# Altium project LedMatrix.PrjPCB (part 1 of 2)
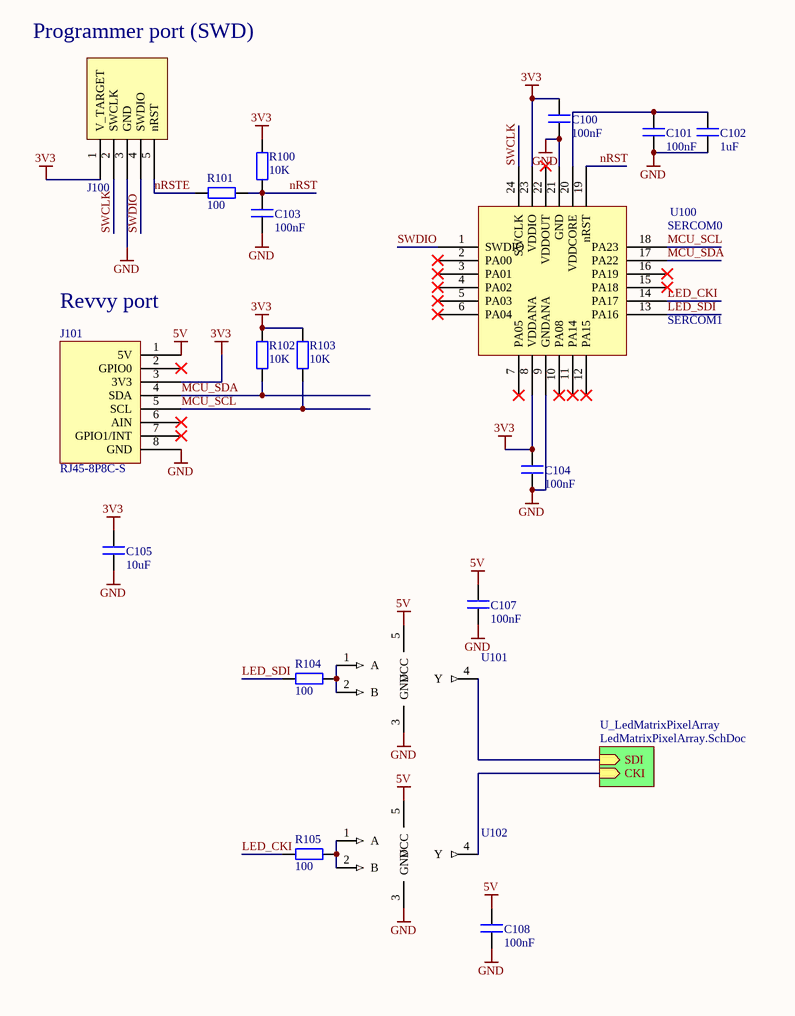
[diagram p0: LedMatrixMain.SchDoc]
3 sheets, 215 parts. Net scope: hierarchical (ports join the sheet entries above them; power ports are global).
Board file: LedMatrix.PcbDoc
Sheets:
  LedMatrixMain.SchDoc
    U_LedMatrixPixelArray = LedMatrixPixelArray.SchDoc
      U_LedMatrixPixel = LedMatrixPixel.SchDoc
      U_LedMatrixPixel = LedMatrixPixel.SchDoc
      U_LedMatrixPixel = LedMatrixPixel.SchDoc
      U_LedMatrixPixel = LedMatrixPixel.SchDoc
      U_LedMatrixPixel = LedMatrixPixel.SchDoc
      U_LedMatrixPixel = LedMatrixPixel.SchDoc
      U_LedMatrixPixel = LedMatrixPixel.SchDoc
      U_LedMatrixPixel = LedMatrixPixel.SchDoc
      U_LedMatrixPixel = LedMatrixPixel.SchDoc
      U_LedMatrixPixel = LedMatrixPixel.SchDoc
      U_LedMatrixPixel = LedMatrixPixel.SchDoc
      U_LedMatrixPixel = LedMatrixPixel.SchDoc
      U_LedMatrixPixel = LedMatrixPixel.SchDoc
      U_LedMatrixPixel = LedMatrixPixel.SchDoc
      U_LedMatrixPixel = LedMatrixPixel.SchDoc
      U_LedMatrixPixel = LedMatrixPixel.SchDoc
      U_LedMatrixPixel = LedMatrixPixel.SchDoc
      U_LedMatrixPixel = LedMatrixPixel.SchDoc
      U_LedMatrixPixel = LedMatrixPixel.SchDoc
      U_LedMatrixPixel = LedMatrixPixel.SchDoc
      U_LedMatrixPixel = LedMatrixPixel.SchDoc
      U_LedMatrixPixel = LedMatrixPixel.SchDoc
      U_LedMatrixPixel = LedMatrixPixel.SchDoc
      U_LedMatrixPixel = LedMatrixPixel.SchDoc
      U_LedMatrixPixel = LedMatrixPixel.SchDoc
      U_LedMatrixPixel = LedMatrixPixel.SchDoc
      U_LedMatrixPixel = LedMatrixPixel.SchDoc
      U_LedMatrixPixel = LedMatrixPixel.SchDoc
      U_LedMatrixPixel = LedMatrixPixel.SchDoc
      U_LedMatrixPixel = LedMatrixPixel.SchDoc
      U_LedMatrixPixel = LedMatrixPixel.SchDoc
      U_LedMatrixPixel = LedMatrixPixel.SchDoc
      U_LedMatrixPixel = LedMatrixPixel.SchDoc
      U_LedMatrixPixel = LedMatrixPixel.SchDoc
      U_LedMatrixPixel = LedMatrixPixel.SchDoc
      U_LedMatrixPixel = LedMatrixPixel.SchDoc
      U_LedMatrixPixel = LedMatrixPixel.SchDoc
      U_LedMatrixPixel = LedMatrixPixel.SchDoc
      U_LedMatrixPixel = LedMatrixPixel.SchDoc
      U_LedMatrixPixel = LedMatrixPixel.SchDoc
      U_LedMatrixPixel = LedMatrixPixel.SchDoc
      U_LedMatrixPixel = LedMatrixPixel.SchDoc
      U_LedMatrixPixel = LedMatrixPixel.SchDoc
      U_LedMatrixPixel = LedMatrixPixel.SchDoc
      U_LedMatrixPixel = LedMatrixPixel.SchDoc
      U_LedMatrixPixel = LedMatrixPixel.SchDoc
      U_LedMatrixPixel = LedMatrixPixel.SchDoc
      U_LedMatrixPixel = LedMatrixPixel.SchDoc
      U_LedMatrixPixel = LedMatrixPixel.SchDoc

## Sheet LedMatrixMain.SchDoc: Led Matrix on Sensor Port
size A4; Revision: 1.0

### Parts
C100  100nF  [CAP1608X06M]
C101  100nF  [CAP1608X06M]
C102  1uF  [CAP1608X06M]
C103  100nF  [CAP1608X06M]
C104  100nF  [CAP1608X06M]
C105  10uF  [CAP1608X06M]
C107  100nF  [CAP1608X06M]
C108  100nF  [CAP1608X06M]
J100  SWD  [Sullins_GRPB051VWVN-RC]  (value not drawn)
J101  RJ45-8P8C-S  [RJ45-8P8C]
R100  10K  [RESC1608X06M]
R101  100  [RESC1608X06M]
R102  10K  [RESC1608X06M]
R103  10K  [RESC1608X06M]
R104  100  [RESC1608X06M]
R105  100  [RESC1608X06M]
U100  ATSAML10D16  [QFN50P400X400X90_HS-25N]  (value not drawn)
U101  OR gate  [SOT95P270X145-5N]  (value not drawn)
U102  OR gate  [SOT95P270X145-5N]  (value not drawn)

### Sub-sheets
U_LedMatrixPixelArray = LedMatrixPixelArray.SchDoc: SDI (in), CKI (in)

### Nets
3V3: C100.2 C104.2 C105.2 J100.1(V_TARGET) J101.3(3V3) R100.2 R102.2 R103.2 U100.8(VDDANA) U100.23(VDDIO)
5V: C107.2 C108.2 J101.1(5V) U101.5(VCC) U102.5(VCC)
GND: C100.1 C101.1 C102.1 C103.1 C104.1 C105.1 C107.1 C108.1 J100.3(GND) J101.8(GND) U100.9(GNDANA) U100.21(GND) U101.3(GND) U102.3(GND)
LED_CKI: R105.1 U100.14(PA17)
LED_SDI: R104.1 U100.13(PA16)
MCU_SCL: J101.5(SCL) R103.1 U100.18(PA23)
MCU_SDA: J101.4(SDA) R102.1 U100.17(PA22)
nRST: C103.2 R100.1 R101.2 U100.19(nRST)
nRSTE: J100.5(nRST) R101.1
SWCLK: J100.2(SWCLK) U100.24(SWCLK)
SWDIO: J100.4(SWDIO) U100.1(SWDIO)
NetC101_2: C101.2 C102.2 U100.20(VDDCORE)
NetR104_2: R104.2 U101.1(A) U101.2(B)
NetR105_2: R105.2 U102.1(A) U102.2(B)
NetR200_U_LedMatrixPixel43_1: U101.4(Y) ; sheet U_LedMatrixPixelArray/SDI
NetR201_U_LedMatrixPixel43_1: U102.4(Y) ; sheet U_LedMatrixPixelArray/CKI

Not connected (* = marked no-connect by the designer): J101 2(GPIO0)* 6(AIN)* 7(GPIO1/INT)*; U100 2(PA00)* 3(PA01)* 4(PA02)* 5(PA03)* 6(PA04)* 7(PA05)* 10(PA08)* 11(PA14)* 12(PA15)* 15(PA18)* 16(PA19)* 22(VDDOUT)*

### Notes on the sheet
- Programmer port (SWD)
- (near U100) SERCOM0
- (near J101) Revvy port
- (near U100) SERCOM1

### Library data of the parts
C100 C101 C103 C104 C107 C108 = Capacitor 100n: Value: 100nF
C102 = Capacitor 1u: Value: 1uF
C105 = Capacitor 10u: Value: 10uF
R100 R102 R103 = Resistor 10K: Value: 10K
R101 R104 R105 = Resistor 100: Value: 100
U100 = ATSAML10D16: 48MHz 32bit ARM MCU; Flash size: 16kB; RAM size: 4kB
U101 U102 = SN74LV1T32: Manufacturer_Name: Texas Instruments; Manufacturer_Part_Number: SN74LV1T32DCKR; Datasheet Link: http://www.ti.com/lit/ds/symlink/sn74lv1t32.pdf; Mouser2 Price/Stock: https://hu.mouser.com/Search/Refine?Keyword=SN74LV1T32DCKR; Mouser code: 595-SN74LV1T32DCKR
J101 = RJ45-8P8C-S: Datasheet: /Robotics%20Platform/Datasheets/Connectors/5721-8P8C-全塑有耳.pdf

## Sheet LedMatrixPixelArray.SchDoc
size A4
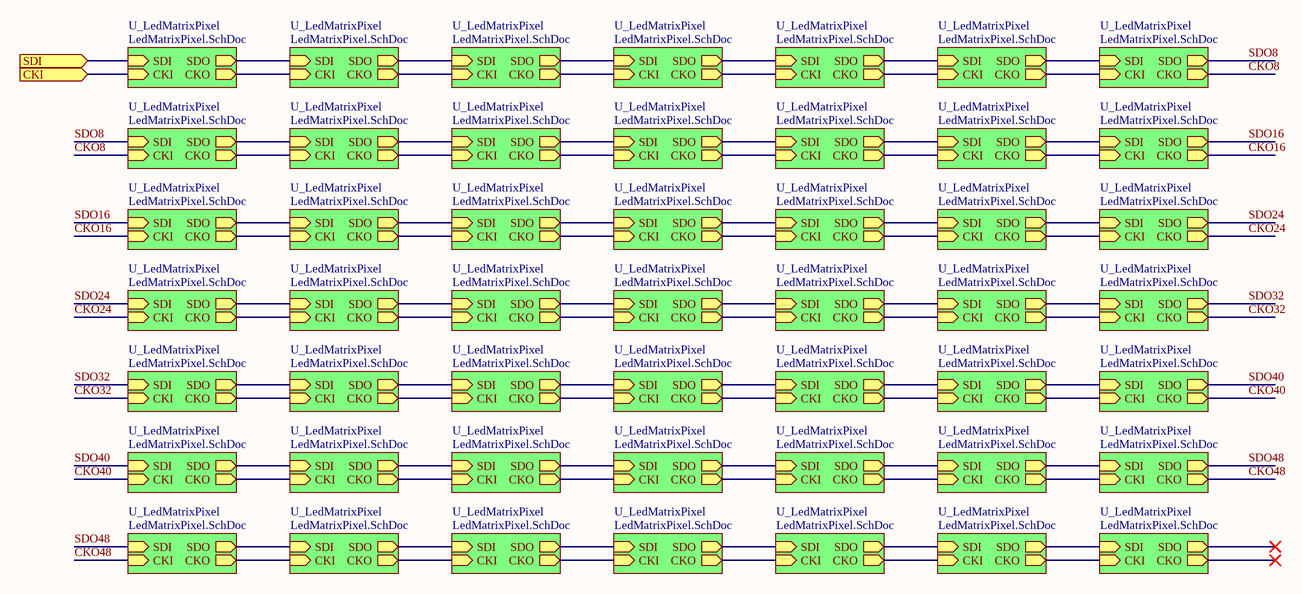
[diagram p1: LedMatrixPixelArray.SchDoc]

### Sub-sheets
U_LedMatrixPixel = LedMatrixPixel.SchDoc: SDI (in), CKI (in), SDO (out), CKO (out)
U_LedMatrixPixel = LedMatrixPixel.SchDoc: SDI (in), CKI (in), SDO (out), CKO (out)
U_LedMatrixPixel = LedMatrixPixel.SchDoc: SDI (in), CKI (in), SDO (out), CKO (out)
U_LedMatrixPixel = LedMatrixPixel.SchDoc: SDI (in), CKI (in), SDO (out), CKO (out)
U_LedMatrixPixel = LedMatrixPixel.SchDoc: SDI (in), CKI (in), SDO (out), CKO (out)
U_LedMatrixPixel = LedMatrixPixel.SchDoc: SDI (in), CKI (in), SDO (out), CKO (out)
U_LedMatrixPixel = LedMatrixPixel.SchDoc: SDI (in), CKI (in), SDO (out), CKO (out)
U_LedMatrixPixel = LedMatrixPixel.SchDoc: SDI (in), CKI (in), SDO (out), CKO (out)
U_LedMatrixPixel = LedMatrixPixel.SchDoc: SDI (in), CKI (in), SDO (out), CKO (out)
U_LedMatrixPixel = LedMatrixPixel.SchDoc: SDI (in), CKI (in), SDO (out), CKO (out)
U_LedMatrixPixel = LedMatrixPixel.SchDoc: SDI (in), CKI (in), SDO (out), CKO (out)
U_LedMatrixPixel = LedMatrixPixel.SchDoc: SDI (in), CKI (in), SDO (out), CKO (out)
U_LedMatrixPixel = LedMatrixPixel.SchDoc: SDI (in), CKI (in), SDO (out), CKO (out)
U_LedMatrixPixel = LedMatrixPixel.SchDoc: SDI (in), CKI (in), SDO (out), CKO (out)
U_LedMatrixPixel = LedMatrixPixel.SchDoc: SDI (in), CKI (in), SDO (out), CKO (out)
U_LedMatrixPixel = LedMatrixPixel.SchDoc: SDI (in), CKI (in), SDO (out), CKO (out)
U_LedMatrixPixel = LedMatrixPixel.SchDoc: SDI (in), CKI (in), SDO (out), CKO (out)
U_LedMatrixPixel = LedMatrixPixel.SchDoc: SDI (in), CKI (in), SDO (out), CKO (out)
U_LedMatrixPixel = LedMatrixPixel.SchDoc: SDI (in), CKI (in), SDO (out), CKO (out)
U_LedMatrixPixel = LedMatrixPixel.SchDoc: SDI (in), CKI (in), SDO (out), CKO (out)
U_LedMatrixPixel = LedMatrixPixel.SchDoc: SDI (in), CKI (in), SDO (out), CKO (out)
U_LedMatrixPixel = LedMatrixPixel.SchDoc: SDI (in), CKI (in), SDO (out), CKO (out)
U_LedMatrixPixel = LedMatrixPixel.SchDoc: SDI (in), CKI (in), SDO (out), CKO (out)
U_LedMatrixPixel = LedMatrixPixel.SchDoc: SDI (in), CKI (in), SDO (out), CKO (out)
U_LedMatrixPixel = LedMatrixPixel.SchDoc: SDI (in), CKI (in), SDO (out), CKO (out)
U_LedMatrixPixel = LedMatrixPixel.SchDoc: SDI (in), CKI (in), SDO (out), CKO (out)
U_LedMatrixPixel = LedMatrixPixel.SchDoc: SDI (in), CKI (in), SDO (out), CKO (out)
U_LedMatrixPixel = LedMatrixPixel.SchDoc: SDI (in), CKI (in), SDO (out), CKO (out)
U_LedMatrixPixel = LedMatrixPixel.SchDoc: SDI (in), CKI (in), SDO (out), CKO (out)
U_LedMatrixPixel = LedMatrixPixel.SchDoc: SDI (in), CKI (in), SDO (out), CKO (out)
U_LedMatrixPixel = LedMatrixPixel.SchDoc: SDI (in), CKI (in), SDO (out), CKO (out)
U_LedMatrixPixel = LedMatrixPixel.SchDoc: SDI (in), CKI (in), SDO (out), CKO (out)
U_LedMatrixPixel = LedMatrixPixel.SchDoc: SDI (in), CKI (in), SDO (out), CKO (out)
U_LedMatrixPixel = LedMatrixPixel.SchDoc: SDI (in), CKI (in), SDO (out), CKO (out)
U_LedMatrixPixel = LedMatrixPixel.SchDoc: SDI (in), CKI (in), SDO (out), CKO (out)
U_LedMatrixPixel = LedMatrixPixel.SchDoc: SDI (in), CKI (in), SDO (out), CKO (out)
U_LedMatrixPixel = LedMatrixPixel.SchDoc: SDI (in), CKI (in), SDO (out), CKO (out)
U_LedMatrixPixel = LedMatrixPixel.SchDoc: SDI (in), CKI (in), SDO (out), CKO (out)
U_LedMatrixPixel = LedMatrixPixel.SchDoc: SDI (in), CKI (in), SDO (out), CKO (out)
U_LedMatrixPixel = LedMatrixPixel.SchDoc: SDI (in), CKI (in), SDO (out), CKO (out)
U_LedMatrixPixel = LedMatrixPixel.SchDoc: SDI (in), CKI (in), SDO (out), CKO (out)
U_LedMatrixPixel = LedMatrixPixel.SchDoc: SDI (in), CKI (in), SDO (out), CKO (out)
U_LedMatrixPixel = LedMatrixPixel.SchDoc: SDI (in), CKI (in), SDO (out), CKO (out)
U_LedMatrixPixel = LedMatrixPixel.SchDoc: SDI (in), CKI (in), SDO (out), CKO (out)
U_LedMatrixPixel = LedMatrixPixel.SchDoc: SDI (in), CKI (in), SDO (out), CKO (out)
U_LedMatrixPixel = LedMatrixPixel.SchDoc: SDI (in), CKI (in), SDO (out), CKO (out)
U_LedMatrixPixel = LedMatrixPixel.SchDoc: SDI (in), CKI (in), SDO (out), CKO (out)
U_LedMatrixPixel = LedMatrixPixel.SchDoc: SDI (in), CKI (in), SDO (out), CKO (out)
U_LedMatrixPixel = LedMatrixPixel.SchDoc: SDI (in), CKI (in), SDO (out), CKO (out)

### Ports
CKI (in), SDI (in)

### Nets
CKO8: sheet U_LedMatrixPixel/CKI, sheet U_LedMatrixPixel/CKO
CKO16: sheet U_LedMatrixPixel/CKI, sheet U_LedMatrixPixel/CKO
CKO24: sheet U_LedMatrixPixel/CKI, sheet U_LedMatrixPixel/CKO
CKO32: sheet U_LedMatrixPixel/CKI, sheet U_LedMatrixPixel/CKO
CKO40: sheet U_LedMatrixPixel/CKI, sheet U_LedMatrixPixel/CKO
CKO48: sheet U_LedMatrixPixel/CKI, sheet U_LedMatrixPixel/CKO
SDO8: sheet U_LedMatrixPixel/SDI, sheet U_LedMatrixPixel/SDO
SDO16: sheet U_LedMatrixPixel/SDI, sheet U_LedMatrixPixel/SDO
SDO24: sheet U_LedMatrixPixel/SDI, sheet U_LedMatrixPixel/SDO
SDO32: sheet U_LedMatrixPixel/SDI, sheet U_LedMatrixPixel/SDO
SDO40: sheet U_LedMatrixPixel/SDI, sheet U_LedMatrixPixel/SDO
SDO48: sheet U_LedMatrixPixel/SDI, sheet U_LedMatrixPixel/SDO
NetR200_U_LedMatrixPixel1_1: sheet U_LedMatrixPixel/SDO, sheet U_LedMatrixPixel/SDI
NetR200_U_LedMatrixPixel2_1: sheet U_LedMatrixPixel/SDO, sheet U_LedMatrixPixel/SDI
NetR200_U_LedMatrixPixel3_1: sheet U_LedMatrixPixel/SDO, sheet U_LedMatrixPixel/SDI
NetR200_U_LedMatrixPixel4_1: sheet U_LedMatrixPixel/SDO, sheet U_LedMatrixPixel/SDI
NetR200_U_LedMatrixPixel5_1: sheet U_LedMatrixPixel/SDO, sheet U_LedMatrixPixel/SDI
NetR200_U_LedMatrixPixel6_1: sheet U_LedMatrixPixel/SDO, sheet U_LedMatrixPixel/SDI
NetR200_U_LedMatrixPixel7_1: sheet U_LedMatrixPixel/SDO, sheet U_LedMatrixPixel/SDI
NetR200_U_LedMatrixPixel8_1: sheet U_LedMatrixPixel/SDO, sheet U_LedMatrixPixel/SDI
NetR200_U_LedMatrixPixel9_1: sheet U_LedMatrixPixel/SDO, sheet U_LedMatrixPixel/SDI
NetR200_U_LedMatrixPixel10_1: sheet U_LedMatrixPixel/SDO, sheet U_LedMatrixPixel/SDI
NetR200_U_LedMatrixPixel11_1: sheet U_LedMatrixPixel/SDO, sheet U_LedMatrixPixel/SDI
NetR200_U_LedMatrixPixel12_1: sheet U_LedMatrixPixel/SDO, sheet U_LedMatrixPixel/SDI
NetR200_U_LedMatrixPixel13_1: sheet U_LedMatrixPixel/SDO, sheet U_LedMatrixPixel/SDI
NetR200_U_LedMatrixPixel14_1: sheet U_LedMatrixPixel/SDO, sheet U_LedMatrixPixel/SDI
NetR200_U_LedMatrixPixel15_1: sheet U_LedMatrixPixel/SDO, sheet U_LedMatrixPixel/SDI
NetR200_U_LedMatrixPixel16_1: sheet U_LedMatrixPixel/SDO, sheet U_LedMatrixPixel/SDI
NetR200_U_LedMatrixPixel17_1: sheet U_LedMatrixPixel/SDO, sheet U_LedMatrixPixel/SDI
NetR200_U_LedMatrixPixel18_1: sheet U_LedMatrixPixel/SDO, sheet U_LedMatrixPixel/SDI
NetR200_U_LedMatrixPixel19_1: sheet U_LedMatrixPixel/SDO, sheet U_LedMatrixPixel/SDI
NetR200_U_LedMatrixPixel20_1: sheet U_LedMatrixPixel/SDO, sheet U_LedMatrixPixel/SDI
NetR200_U_LedMatrixPixel21_1: sheet U_LedMatrixPixel/SDO, sheet U_LedMatrixPixel/SDI
NetR200_U_LedMatrixPixel22_1: sheet U_LedMatrixPixel/SDO, sheet U_LedMatrixPixel/SDI
NetR200_U_LedMatrixPixel23_1: sheet U_LedMatrixPixel/SDO, sheet U_LedMatrixPixel/SDI
NetR200_U_LedMatrixPixel24_1: sheet U_LedMatrixPixel/SDO, sheet U_LedMatrixPixel/SDI
NetR200_U_LedMatrixPixel25_1: sheet U_LedMatrixPixel/SDO, sheet U_LedMatrixPixel/SDI
NetR200_U_LedMatrixPixel26_1: sheet U_LedMatrixPixel/SDO, sheet U_LedMatrixPixel/SDI
NetR200_U_LedMatrixPixel27_1: sheet U_LedMatrixPixel/SDO, sheet U_LedMatrixPixel/SDI
NetR200_U_LedMatrixPixel28_1: sheet U_LedMatrixPixel/SDO, sheet U_LedMatrixPixel/SDI
NetR200_U_LedMatrixPixel29_1: sheet U_LedMatrixPixel/SDO, sheet U_LedMatrixPixel/SDI
NetR200_U_LedMatrixPixel30_1: sheet U_LedMatrixPixel/SDO, sheet U_LedMatrixPixel/SDI
NetR200_U_LedMatrixPixel31_1: sheet U_LedMatrixPixel/SDO, sheet U_LedMatrixPixel/SDI
NetR200_U_LedMatrixPixel32_1: sheet U_LedMatrixPixel/SDO, sheet U_LedMatrixPixel/SDI
NetR200_U_LedMatrixPixel33_1: sheet U_LedMatrixPixel/SDO, sheet U_LedMatrixPixel/SDI
NetR200_U_LedMatrixPixel34_1: sheet U_LedMatrixPixel/SDO, sheet U_LedMatrixPixel/SDI
NetR200_U_LedMatrixPixel35_1: sheet U_LedMatrixPixel/SDO, sheet U_LedMatrixPixel/SDI
NetR200_U_LedMatrixPixel36_1: sheet U_LedMatrixPixel/SDO, sheet U_LedMatrixPixel/SDI
NetR200_U_LedMatrixPixel37_1: sheet U_LedMatrixPixel/SDO, sheet U_LedMatrixPixel/SDI
NetR200_U_LedMatrixPixel38_1: sheet U_LedMatrixPixel/SDO, sheet U_LedMatrixPixel/SDI
NetR200_U_LedMatrixPixel39_1: sheet U_LedMatrixPixel/SDO, sheet U_LedMatrixPixel/SDI
NetR200_U_LedMatrixPixel40_1: sheet U_LedMatrixPixel/SDO, sheet U_LedMatrixPixel/SDI
NetR200_U_LedMatrixPixel41_1: sheet U_LedMatrixPixel/SDO, sheet U_LedMatrixPixel/SDI
NetR200_U_LedMatrixPixel42_1: sheet U_LedMatrixPixel/SDO, sheet U_LedMatrixPixel/SDI
NetR200_U_LedMatrixPixel43_1: port SDI, sheet U_LedMatrixPixel/SDI
NetR201_U_LedMatrixPixel1_1: sheet U_LedMatrixPixel/CKO, sheet U_LedMatrixPixel/CKI
NetR201_U_LedMatrixPixel2_1: sheet U_LedMatrixPixel/CKO, sheet U_LedMatrixPixel/CKI
NetR201_U_LedMatrixPixel3_1: sheet U_LedMatrixPixel/CKO, sheet U_LedMatrixPixel/CKI
NetR201_U_LedMatrixPixel4_1: sheet U_LedMatrixPixel/CKO, sheet U_LedMatrixPixel/CKI
NetR201_U_LedMatrixPixel5_1: sheet U_LedMatrixPixel/CKO, sheet U_LedMatrixPixel/CKI
NetR201_U_LedMatrixPixel6_1: sheet U_LedMatrixPixel/CKO, sheet U_LedMatrixPixel/CKI
NetR201_U_LedMatrixPixel7_1: sheet U_LedMatrixPixel/CKO, sheet U_LedMatrixPixel/CKI
NetR201_U_LedMatrixPixel8_1: sheet U_LedMatrixPixel/CKO, sheet U_LedMatrixPixel/CKI
NetR201_U_LedMatrixPixel9_1: sheet U_LedMatrixPixel/CKO, sheet U_LedMatrixPixel/CKI
NetR201_U_LedMatrixPixel10_1: sheet U_LedMatrixPixel/CKO, sheet U_LedMatrixPixel/CKI
NetR201_U_LedMatrixPixel11_1: sheet U_LedMatrixPixel/CKO, sheet U_LedMatrixPixel/CKI
NetR201_U_LedMatrixPixel12_1: sheet U_LedMatrixPixel/CKO, sheet U_LedMatrixPixel/CKI
NetR201_U_LedMatrixPixel13_1: sheet U_LedMatrixPixel/CKO, sheet U_LedMatrixPixel/CKI
NetR201_U_LedMatrixPixel14_1: sheet U_LedMatrixPixel/CKO, sheet U_LedMatrixPixel/CKI
NetR201_U_LedMatrixPixel15_1: sheet U_LedMatrixPixel/CKO, sheet U_LedMatrixPixel/CKI
NetR201_U_LedMatrixPixel16_1: sheet U_LedMatrixPixel/CKO, sheet U_LedMatrixPixel/CKI
NetR201_U_LedMatrixPixel17_1: sheet U_LedMatrixPixel/CKO, sheet U_LedMatrixPixel/CKI
NetR201_U_LedMatrixPixel18_1: sheet U_LedMatrixPixel/CKO, sheet U_LedMatrixPixel/CKI
NetR201_U_LedMatrixPixel19_1: sheet U_LedMatrixPixel/CKO, sheet U_LedMatrixPixel/CKI
NetR201_U_LedMatrixPixel20_1: sheet U_LedMatrixPixel/CKO, sheet U_LedMatrixPixel/CKI
NetR201_U_LedMatrixPixel21_1: sheet U_LedMatrixPixel/CKO, sheet U_LedMatrixPixel/CKI
NetR201_U_LedMatrixPixel22_1: sheet U_LedMatrixPixel/CKO, sheet U_LedMatrixPixel/CKI
NetR201_U_LedMatrixPixel23_1: sheet U_LedMatrixPixel/CKO, sheet U_LedMatrixPixel/CKI
NetR201_U_LedMatrixPixel24_1: sheet U_LedMatrixPixel/CKO, sheet U_LedMatrixPixel/CKI
NetR201_U_LedMatrixPixel25_1: sheet U_LedMatrixPixel/CKO, sheet U_LedMatrixPixel/CKI
NetR201_U_LedMatrixPixel26_1: sheet U_LedMatrixPixel/CKO, sheet U_LedMatrixPixel/CKI
NetR201_U_LedMatrixPixel27_1: sheet U_LedMatrixPixel/CKO, sheet U_LedMatrixPixel/CKI
NetR201_U_LedMatrixPixel28_1: sheet U_LedMatrixPixel/CKO, sheet U_LedMatrixPixel/CKI
NetR201_U_LedMatrixPixel29_1: sheet U_LedMatrixPixel/CKO, sheet U_LedMatrixPixel/CKI
NetR201_U_LedMatrixPixel30_1: sheet U_LedMatrixPixel/CKO, sheet U_LedMatrixPixel/CKI
NetR201_U_LedMatrixPixel31_1: sheet U_LedMatrixPixel/CKO, sheet U_LedMatrixPixel/CKI
NetR201_U_LedMatrixPixel32_1: sheet U_LedMatrixPixel/CKO, sheet U_LedMatrixPixel/CKI
NetR201_U_LedMatrixPixel33_1: sheet U_LedMatrixPixel/CKO, sheet U_LedMatrixPixel/CKI
NetR201_U_LedMatrixPixel34_1: sheet U_LedMatrixPixel/CKO, sheet U_LedMatrixPixel/CKI
NetR201_U_LedMatrixPixel35_1: sheet U_LedMatrixPixel/CKO, sheet U_LedMatrixPixel/CKI
NetR201_U_LedMatrixPixel36_1: sheet U_LedMatrixPixel/CKO, sheet U_LedMatrixPixel/CKI
NetR201_U_LedMatrixPixel37_1: sheet U_LedMatrixPixel/CKO, sheet U_LedMatrixPixel/CKI
NetR201_U_LedMatrixPixel38_1: sheet U_LedMatrixPixel/CKO, sheet U_LedMatrixPixel/CKI
NetR201_U_LedMatrixPixel39_1: sheet U_LedMatrixPixel/CKO, sheet U_LedMatrixPixel/CKI
NetR201_U_LedMatrixPixel40_1: sheet U_LedMatrixPixel/CKO, sheet U_LedMatrixPixel/CKI
NetR201_U_LedMatrixPixel41_1: sheet U_LedMatrixPixel/CKO, sheet U_LedMatrixPixel/CKI
NetR201_U_LedMatrixPixel42_1: sheet U_LedMatrixPixel/CKO, sheet U_LedMatrixPixel/CKI
NetR201_U_LedMatrixPixel43_1: port CKI, sheet U_LedMatrixPixel/CKI

## Sheet LedMatrixPixel.SchDoc
size A4
Used 49 times, as channels U_LedMatrixPixelArray/U_LedMatrixPixel, U_LedMatrixPixelArray/U_LedMatrixPixel, U_LedMatrixPixelArray/U_LedMatrixPixel, U_LedMatrixPixelArray/U_LedMatrixPixel, U_LedMatrixPixelArray/U_LedMatrixPixel, U_LedMatrixPixelArray/U_LedMatrixPixel, U_LedMatrixPixelArray/U_LedMatrixPixel, U_LedMatrixPixelArray/U_LedMatrixPixel, U_LedMatrixPixelArray/U_LedMatrixPixel, U_LedMatrixPixelArray/U_LedMatrixPixel, U_LedMatrixPixelArray/U_LedMatrixPixel, U_LedMatrixPixelArray/U_LedMatrixPixel, U_LedMatrixPixelArray/U_LedMatrixPixel, U_LedMatrixPixelArray/U_LedMatrixPixel, U_LedMatrixPixelArray/U_LedMatrixPixel, U_LedMatrixPixelArray/U_LedMatrixPixel, U_LedMatrixPixelArray/U_LedMatrixPixel, U_LedMatrixPixelArray/U_LedMatrixPixel, U_LedMatrixPixelArray/U_LedMatrixPixel, U_LedMatrixPixelArray/U_LedMatrixPixel, U_LedMatrixPixelArray/U_LedMatrixPixel, U_LedMatrixPixelArray/U_LedMatrixPixel, U_LedMatrixPixelArray/U_LedMatrixPixel, U_LedMatrixPixelArray/U_LedMatrixPixel, U_LedMatrixPixelArray/U_LedMatrixPixel, U_LedMatrixPixelArray/U_LedMatrixPixel, U_LedMatrixPixelArray/U_LedMatrixPixel, U_LedMatrixPixelArray/U_LedMatrixPixel, U_LedMatrixPixelArray/U_LedMatrixPixel, U_LedMatrixPixelArray/U_LedMatrixPixel, U_LedMatrixPixelArray/U_LedMatrixPixel, U_LedMatrixPixelArray/U_LedMatrixPixel, U_LedMatrixPixelArray/U_LedMatrixPixel, U_LedMatrixPixelArray/U_LedMatrixPixel, U_LedMatrixPixelArray/U_LedMatrixPixel, U_LedMatrixPixelArray/U_LedMatrixPixel, U_LedMatrixPixelArray/U_LedMatrixPixel, U_LedMatrixPixelArray/U_LedMatrixPixel, U_LedMatrixPixelArray/U_LedMatrixPixel, U_LedMatrixPixelArray/U_LedMatrixPixel, U_LedMatrixPixelArray/U_LedMatrixPixel, U_LedMatrixPixelArray/U_LedMatrixPixel, U_LedMatrixPixelArray/U_LedMatrixPixel, U_LedMatrixPixelArray/U_LedMatrixPixel, U_LedMatrixPixelArray/U_LedMatrixPixel, U_LedMatrixPixelArray/U_LedMatrixPixel, U_LedMatrixPixelArray/U_LedMatrixPixel, U_LedMatrixPixelArray/U_LedMatrixPixel, U_LedMatrixPixelArray/U_LedMatrixPixel. Parts and nets are listed once, with the designators drawn on the sheet.
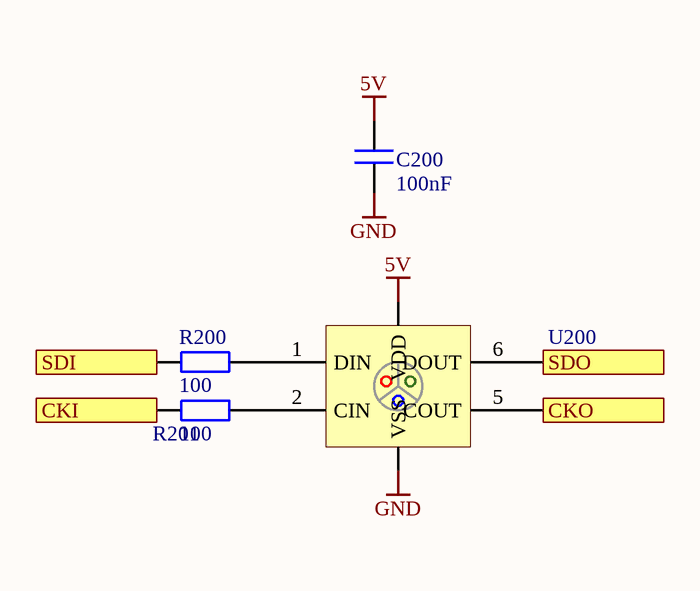
[diagram p2: LedMatrixPixel.SchDoc]

### Parts
C200  100nF  [CAP1608X06M]
R200  100  [RESC1608X06M]
R201  100  [RESC1608X06M]
U200  APA102-2020  [APA102]  (value not drawn)

### Ports
CKI (in), CKO (out), SDI (in), SDO (out)

### Nets
5V: C200.2 U200.4(VDD)
GND: C200.1 U200.3(VSS)
CKI: R201.1 ; port CKI
CKO: U200.5(COUT) ; port CKO
SDI: R200.1 ; port SDI
SDO: U200.6(DOUT) ; port SDO
NetR200_2: R200.2 U200.1(DIN)
NetR201_2: R201.2 U200.2(CIN)

### Channels
U_LedMatrixPixelArray/U_LedMatrixPixel: designators end in _U_LedMatrixPixel49; ports CKI=CKO48 CKO=NetR201_U_LedMatrixPixel42_1 SDI=SDO48 SDO=NetR200_U_LedMatrixPixel42_1
U_LedMatrixPixelArray/U_LedMatrixPixel: designators end in _U_LedMatrixPixel48; ports CKI=CKO40 CKO=NetR201_U_LedMatrixPixel41_1 SDI=SDO40 SDO=NetR200_U_LedMatrixPixel41_1
U_LedMatrixPixelArray/U_LedMatrixPixel: designators end in _U_LedMatrixPixel47; ports CKI=CKO32 CKO=NetR201_U_LedMatrixPixel40_1 SDI=SDO32 SDO=NetR200_U_LedMatrixPixel40_1
U_LedMatrixPixelArray/U_LedMatrixPixel: designators end in _U_LedMatrixPixel46; ports CKI=CKO24 CKO=NetR201_U_LedMatrixPixel39_1 SDI=SDO24 SDO=NetR200_U_LedMatrixPixel39_1
U_LedMatrixPixelArray/U_LedMatrixPixel: designators end in _U_LedMatrixPixel45; ports CKI=CKO16 CKO=NetR201_U_LedMatrixPixel38_1 SDI=SDO16 SDO=NetR200_U_LedMatrixPixel38_1
U_LedMatrixPixelArray/U_LedMatrixPixel: designators end in _U_LedMatrixPixel44; ports CKI=CKO8 CKO=NetR201_U_LedMatrixPixel37_1 SDI=SDO8 SDO=NetR200_U_LedMatrixPixel37_1
U_LedMatrixPixelArray/U_LedMatrixPixel: designators end in _U_LedMatrixPixel43; ports CKI=NetR201_U_LedMatrixPixel43_1 CKO=NetR201_U_LedMatrixPixel36_1 SDI=NetR200_U_LedMatrixPixel43_1 SDO=NetR200_U_LedMatrixPixel36_1
U_LedMatrixPixelArray/U_LedMatrixPixel: designators end in _U_LedMatrixPixel42; ports CKI=NetR201_U_LedMatrixPixel42_1 CKO=NetR201_U_LedMatrixPixel35_1 SDI=NetR200_U_LedMatrixPixel42_1 SDO=NetR200_U_LedMatrixPixel35_1
U_LedMatrixPixelArray/U_LedMatrixPixel: designators end in _U_LedMatrixPixel41; ports CKI=NetR201_U_LedMatrixPixel41_1 CKO=NetR201_U_LedMatrixPixel34_1 SDI=NetR200_U_LedMatrixPixel41_1 SDO=NetR200_U_LedMatrixPixel34_1
U_LedMatrixPixelArray/U_LedMatrixPixel: designators end in _U_LedMatrixPixel40; ports CKI=NetR201_U_LedMatrixPixel40_1 CKO=NetR201_U_LedMatrixPixel33_1 SDI=NetR200_U_LedMatrixPixel40_1 SDO=NetR200_U_LedMatrixPixel33_1
U_LedMatrixPixelArray/U_LedMatrixPixel: designators end in _U_LedMatrixPixel39; ports CKI=NetR201_U_LedMatrixPixel39_1 CKO=NetR201_U_LedMatrixPixel32_1 SDI=NetR200_U_LedMatrixPixel39_1 SDO=NetR200_U_LedMatrixPixel32_1
U_LedMatrixPixelArray/U_LedMatrixPixel: designators end in _U_LedMatrixPixel38; ports CKI=NetR201_U_LedMatrixPixel38_1 CKO=NetR201_U_LedMatrixPixel31_1 SDI=NetR200_U_LedMatrixPixel38_1 SDO=NetR200_U_LedMatrixPixel31_1
U_LedMatrixPixelArray/U_LedMatrixPixel: designators end in _U_LedMatrixPixel37; ports CKI=NetR201_U_LedMatrixPixel37_1 CKO=NetR201_U_LedMatrixPixel30_1 SDI=NetR200_U_LedMatrixPixel37_1 SDO=NetR200_U_LedMatrixPixel30_1
U_LedMatrixPixelArray/U_LedMatrixPixel: designators end in _U_LedMatrixPixel36; ports CKI=NetR201_U_LedMatrixPixel36_1 CKO=NetR201_U_LedMatrixPixel29_1 SDI=NetR200_U_LedMatrixPixel36_1 SDO=NetR200_U_LedMatrixPixel29_1
U_LedMatrixPixelArray/U_LedMatrixPixel: designators end in _U_LedMatrixPixel35; ports CKI=NetR201_U_LedMatrixPixel35_1 CKO=NetR201_U_LedMatrixPixel28_1 SDI=NetR200_U_LedMatrixPixel35_1 SDO=NetR200_U_LedMatrixPixel28_1
U_LedMatrixPixelArray/U_LedMatrixPixel: designators end in _U_LedMatrixPixel34; ports CKI=NetR201_U_LedMatrixPixel34_1 CKO=NetR201_U_LedMatrixPixel27_1 SDI=NetR200_U_LedMatrixPixel34_1 SDO=NetR200_U_LedMatrixPixel27_1
U_LedMatrixPixelArray/U_LedMatrixPixel: designators end in _U_LedMatrixPixel33; ports CKI=NetR201_U_LedMatrixPixel33_1 CKO=NetR201_U_LedMatrixPixel26_1 SDI=NetR200_U_LedMatrixPixel33_1 SDO=NetR200_U_LedMatrixPixel26_1
U_LedMatrixPixelArray/U_LedMatrixPixel: designators end in _U_LedMatrixPixel32; ports CKI=NetR201_U_LedMatrixPixel32_1 CKO=NetR201_U_LedMatrixPixel25_1 SDI=NetR200_U_LedMatrixPixel32_1 SDO=NetR200_U_LedMatrixPixel25_1
U_LedMatrixPixelArray/U_LedMatrixPixel: designators end in _U_LedMatrixPixel31; ports CKI=NetR201_U_LedMatrixPixel31_1 CKO=NetR201_U_LedMatrixPixel24_1 SDI=NetR200_U_LedMatrixPixel31_1 SDO=NetR200_U_LedMatrixPixel24_1
U_LedMatrixPixelArray/U_LedMatrixPixel: designators end in _U_LedMatrixPixel30; ports CKI=NetR201_U_LedMatrixPixel30_1 CKO=NetR201_U_LedMatrixPixel23_1 SDI=NetR200_U_LedMatrixPixel30_1 SDO=NetR200_U_LedMatrixPixel23_1
U_LedMatrixPixelArray/U_LedMatrixPixel: designators end in _U_LedMatrixPixel29; ports CKI=NetR201_U_LedMatrixPixel29_1 CKO=NetR201_U_LedMatrixPixel22_1 SDI=NetR200_U_LedMatrixPixel29_1 SDO=NetR200_U_LedMatrixPixel22_1
U_LedMatrixPixelArray/U_LedMatrixPixel: designators end in _U_LedMatrixPixel28; ports CKI=NetR201_U_LedMatrixPixel28_1 CKO=NetR201_U_LedMatrixPixel21_1 SDI=NetR200_U_LedMatrixPixel28_1 SDO=NetR200_U_LedMatrixPixel21_1
U_LedMatrixPixelArray/U_LedMatrixPixel: designators end in _U_LedMatrixPixel27; ports CKI=NetR201_U_LedMatrixPixel27_1 CKO=NetR201_U_LedMatrixPixel20_1 SDI=NetR200_U_LedMatrixPixel27_1 SDO=NetR200_U_LedMatrixPixel20_1
U_LedMatrixPixelArray/U_LedMatrixPixel: designators end in _U_LedMatrixPixel26; ports CKI=NetR201_U_LedMatrixPixel26_1 CKO=NetR201_U_LedMatrixPixel19_1 SDI=NetR200_U_LedMatrixPixel26_1 SDO=NetR200_U_LedMatrixPixel19_1
U_LedMatrixPixelArray/U_LedMatrixPixel: designators end in _U_LedMatrixPixel25; ports CKI=NetR201_U_LedMatrixPixel25_1 CKO=NetR201_U_LedMatrixPixel18_1 SDI=NetR200_U_LedMatrixPixel25_1 SDO=NetR200_U_LedMatrixPixel18_1
U_LedMatrixPixelArray/U_LedMatrixPixel: designators end in _U_LedMatrixPixel24; ports CKI=NetR201_U_LedMatrixPixel24_1 CKO=NetR201_U_LedMatrixPixel17_1 SDI=NetR200_U_LedMatrixPixel24_1 SDO=NetR200_U_LedMatrixPixel17_1
U_LedMatrixPixelArray/U_LedMatrixPixel: designators end in _U_LedMatrixPixel23; ports CKI=NetR201_U_LedMatrixPixel23_1 CKO=NetR201_U_LedMatrixPixel16_1 SDI=NetR200_U_LedMatrixPixel23_1 SDO=NetR200_U_LedMatrixPixel16_1
U_LedMatrixPixelArray/U_LedMatrixPixel: designators end in _U_LedMatrixPixel22; ports CKI=NetR201_U_LedMatrixPixel22_1 CKO=NetR201_U_LedMatrixPixel15_1 SDI=NetR200_U_LedMatrixPixel22_1 SDO=NetR200_U_LedMatrixPixel15_1
U_LedMatrixPixelArray/U_LedMatrixPixel: designators end in _U_LedMatrixPixel21; ports CKI=NetR201_U_LedMatrixPixel21_1 CKO=NetR201_U_LedMatrixPixel14_1 SDI=NetR200_U_LedMatrixPixel21_1 SDO=NetR200_U_LedMatrixPixel14_1
U_LedMatrixPixelArray/U_LedMatrixPixel: designators end in _U_LedMatrixPixel20; ports CKI=NetR201_U_LedMatrixPixel20_1 CKO=NetR201_U_LedMatrixPixel13_1 SDI=NetR200_U_LedMatrixPixel20_1 SDO=NetR200_U_LedMatrixPixel13_1
U_LedMatrixPixelArray/U_LedMatrixPixel: designators end in _U_LedMatrixPixel19; ports CKI=NetR201_U_LedMatrixPixel19_1 CKO=NetR201_U_LedMatrixPixel12_1 SDI=NetR200_U_LedMatrixPixel19_1 SDO=NetR200_U_LedMatrixPixel12_1
U_LedMatrixPixelArray/U_LedMatrixPixel: designators end in _U_LedMatrixPixel18; ports CKI=NetR201_U_LedMatrixPixel18_1 CKO=NetR201_U_LedMatrixPixel11_1 SDI=NetR200_U_LedMatrixPixel18_1 SDO=NetR200_U_LedMatrixPixel11_1
U_LedMatrixPixelArray/U_LedMatrixPixel: designators end in _U_LedMatrixPixel17; ports CKI=NetR201_U_LedMatrixPixel17_1 CKO=NetR201_U_LedMatrixPixel10_1 SDI=NetR200_U_LedMatrixPixel17_1 SDO=NetR200_U_LedMatrixPixel10_1
U_LedMatrixPixelArray/U_LedMatrixPixel: designators end in _U_LedMatrixPixel16; ports CKI=NetR201_U_LedMatrixPixel16_1 CKO=NetR201_U_LedMatrixPixel9_1 SDI=NetR200_U_LedMatrixPixel16_1 SDO=NetR200_U_LedMatrixPixel9_1
U_LedMatrixPixelArray/U_LedMatrixPixel: designators end in _U_LedMatrixPixel15; ports CKI=NetR201_U_LedMatrixPixel15_1 CKO=NetR201_U_LedMatrixPixel8_1 SDI=NetR200_U_LedMatrixPixel15_1 SDO=NetR200_U_LedMatrixPixel8_1
U_LedMatrixPixelArray/U_LedMatrixPixel: designators end in _U_LedMatrixPixel14; ports CKI=NetR201_U_LedMatrixPixel14_1 CKO=NetR201_U_LedMatrixPixel7_1 SDI=NetR200_U_LedMatrixPixel14_1 SDO=NetR200_U_LedMatrixPixel7_1
U_LedMatrixPixelArray/U_LedMatrixPixel: designators end in _U_LedMatrixPixel13; ports CKI=NetR201_U_LedMatrixPixel13_1 CKO=NetR201_U_LedMatrixPixel6_1 SDI=NetR200_U_LedMatrixPixel13_1 SDO=NetR200_U_LedMatrixPixel6_1
U_LedMatrixPixelArray/U_LedMatrixPixel: designators end in _U_LedMatrixPixel12; ports CKI=NetR201_U_LedMatrixPixel12_1 CKO=NetR201_U_LedMatrixPixel5_1 SDI=NetR200_U_LedMatrixPixel12_1 SDO=NetR200_U_LedMatrixPixel5_1
U_LedMatrixPixelArray/U_LedMatrixPixel: designators end in _U_LedMatrixPixel11; ports CKI=NetR201_U_LedMatrixPixel11_1 CKO=NetR201_U_LedMatrixPixel4_1 SDI=NetR200_U_LedMatrixPixel11_1 SDO=NetR200_U_LedMatrixPixel4_1
U_LedMatrixPixelArray/U_LedMatrixPixel: designators end in _U_LedMatrixPixel10; ports CKI=NetR201_U_LedMatrixPixel10_1 CKO=NetR201_U_LedMatrixPixel3_1 SDI=NetR200_U_LedMatrixPixel10_1 SDO=NetR200_U_LedMatrixPixel3_1
U_LedMatrixPixelArray/U_LedMatrixPixel: designators end in _U_LedMatrixPixel9; ports CKI=NetR201_U_LedMatrixPixel9_1 CKO=NetR201_U_LedMatrixPixel2_1 SDI=NetR200_U_LedMatrixPixel9_1 SDO=NetR200_U_LedMatrixPixel2_1
U_LedMatrixPixelArray/U_LedMatrixPixel: designators end in _U_LedMatrixPixel8; ports CKI=NetR201_U_LedMatrixPixel8_1 CKO=NetR201_U_LedMatrixPixel1_1 SDI=NetR200_U_LedMatrixPixel8_1 SDO=NetR200_U_LedMatrixPixel1_1
U_LedMatrixPixelArray/U_LedMatrixPixel: designators end in _U_LedMatrixPixel7; ports CKI=NetR201_U_LedMatrixPixel7_1 CKO=NetU200_U_LedMatrixPixel7_5 SDI=NetR200_U_LedMatrixPixel7_1 SDO=NetU200_U_LedMatrixPixel7_6
U_LedMatrixPixelArray/U_LedMatrixPixel: designators end in _U_LedMatrixPixel6; ports CKI=NetR201_U_LedMatrixPixel6_1 CKO=CKO48 SDI=NetR200_U_LedMatrixPixel6_1 SDO=SDO48
U_LedMatrixPixelArray/U_LedMatrixPixel: designators end in _U_LedMatrixPixel5; ports CKI=NetR201_U_LedMatrixPixel5_1 CKO=CKO40 SDI=NetR200_U_LedMatrixPixel5_1 SDO=SDO40
U_LedMatrixPixelArray/U_LedMatrixPixel: designators end in _U_LedMatrixPixel4; ports CKI=NetR201_U_LedMatrixPixel4_1 CKO=CKO32 SDI=NetR200_U_LedMatrixPixel4_1 SDO=SDO32
U_LedMatrixPixelArray/U_LedMatrixPixel: designators end in _U_LedMatrixPixel3; ports CKI=NetR201_U_LedMatrixPixel3_1 CKO=CKO24 SDI=NetR200_U_LedMatrixPixel3_1 SDO=SDO24
U_LedMatrixPixelArray/U_LedMatrixPixel: designators end in _U_LedMatrixPixel2; ports CKI=NetR201_U_LedMatrixPixel2_1 CKO=CKO16 SDI=NetR200_U_LedMatrixPixel2_1 SDO=SDO16
U_LedMatrixPixelArray/U_LedMatrixPixel: designators end in _U_LedMatrixPixel1; ports CKI=NetR201_U_LedMatrixPixel1_1 CKO=CKO8 SDI=NetR200_U_LedMatrixPixel1_1 SDO=SDO8

### Library data of the parts
C200 = Capacitor 100n: Value: 100nF
R200 R201 = Resistor 100: Value: 100
U200 = APA102-2020: RGB LED